# Altium schematic sheet BMS_V3.SchDoc: QEV1/2 Battery Management System
size A3; DrawnBy: Billy Currie, Alistair Ridge; Organization: QUT Motorsport; Address1: O-120, O Block; Address2: QUT Gardnes Point; Address3: Brisbane, QLD; Address4: Australia, 4000; DocumentNumber: 1000000; Revision: V1.1; SheetNumber: 1; SheetTotal: 1
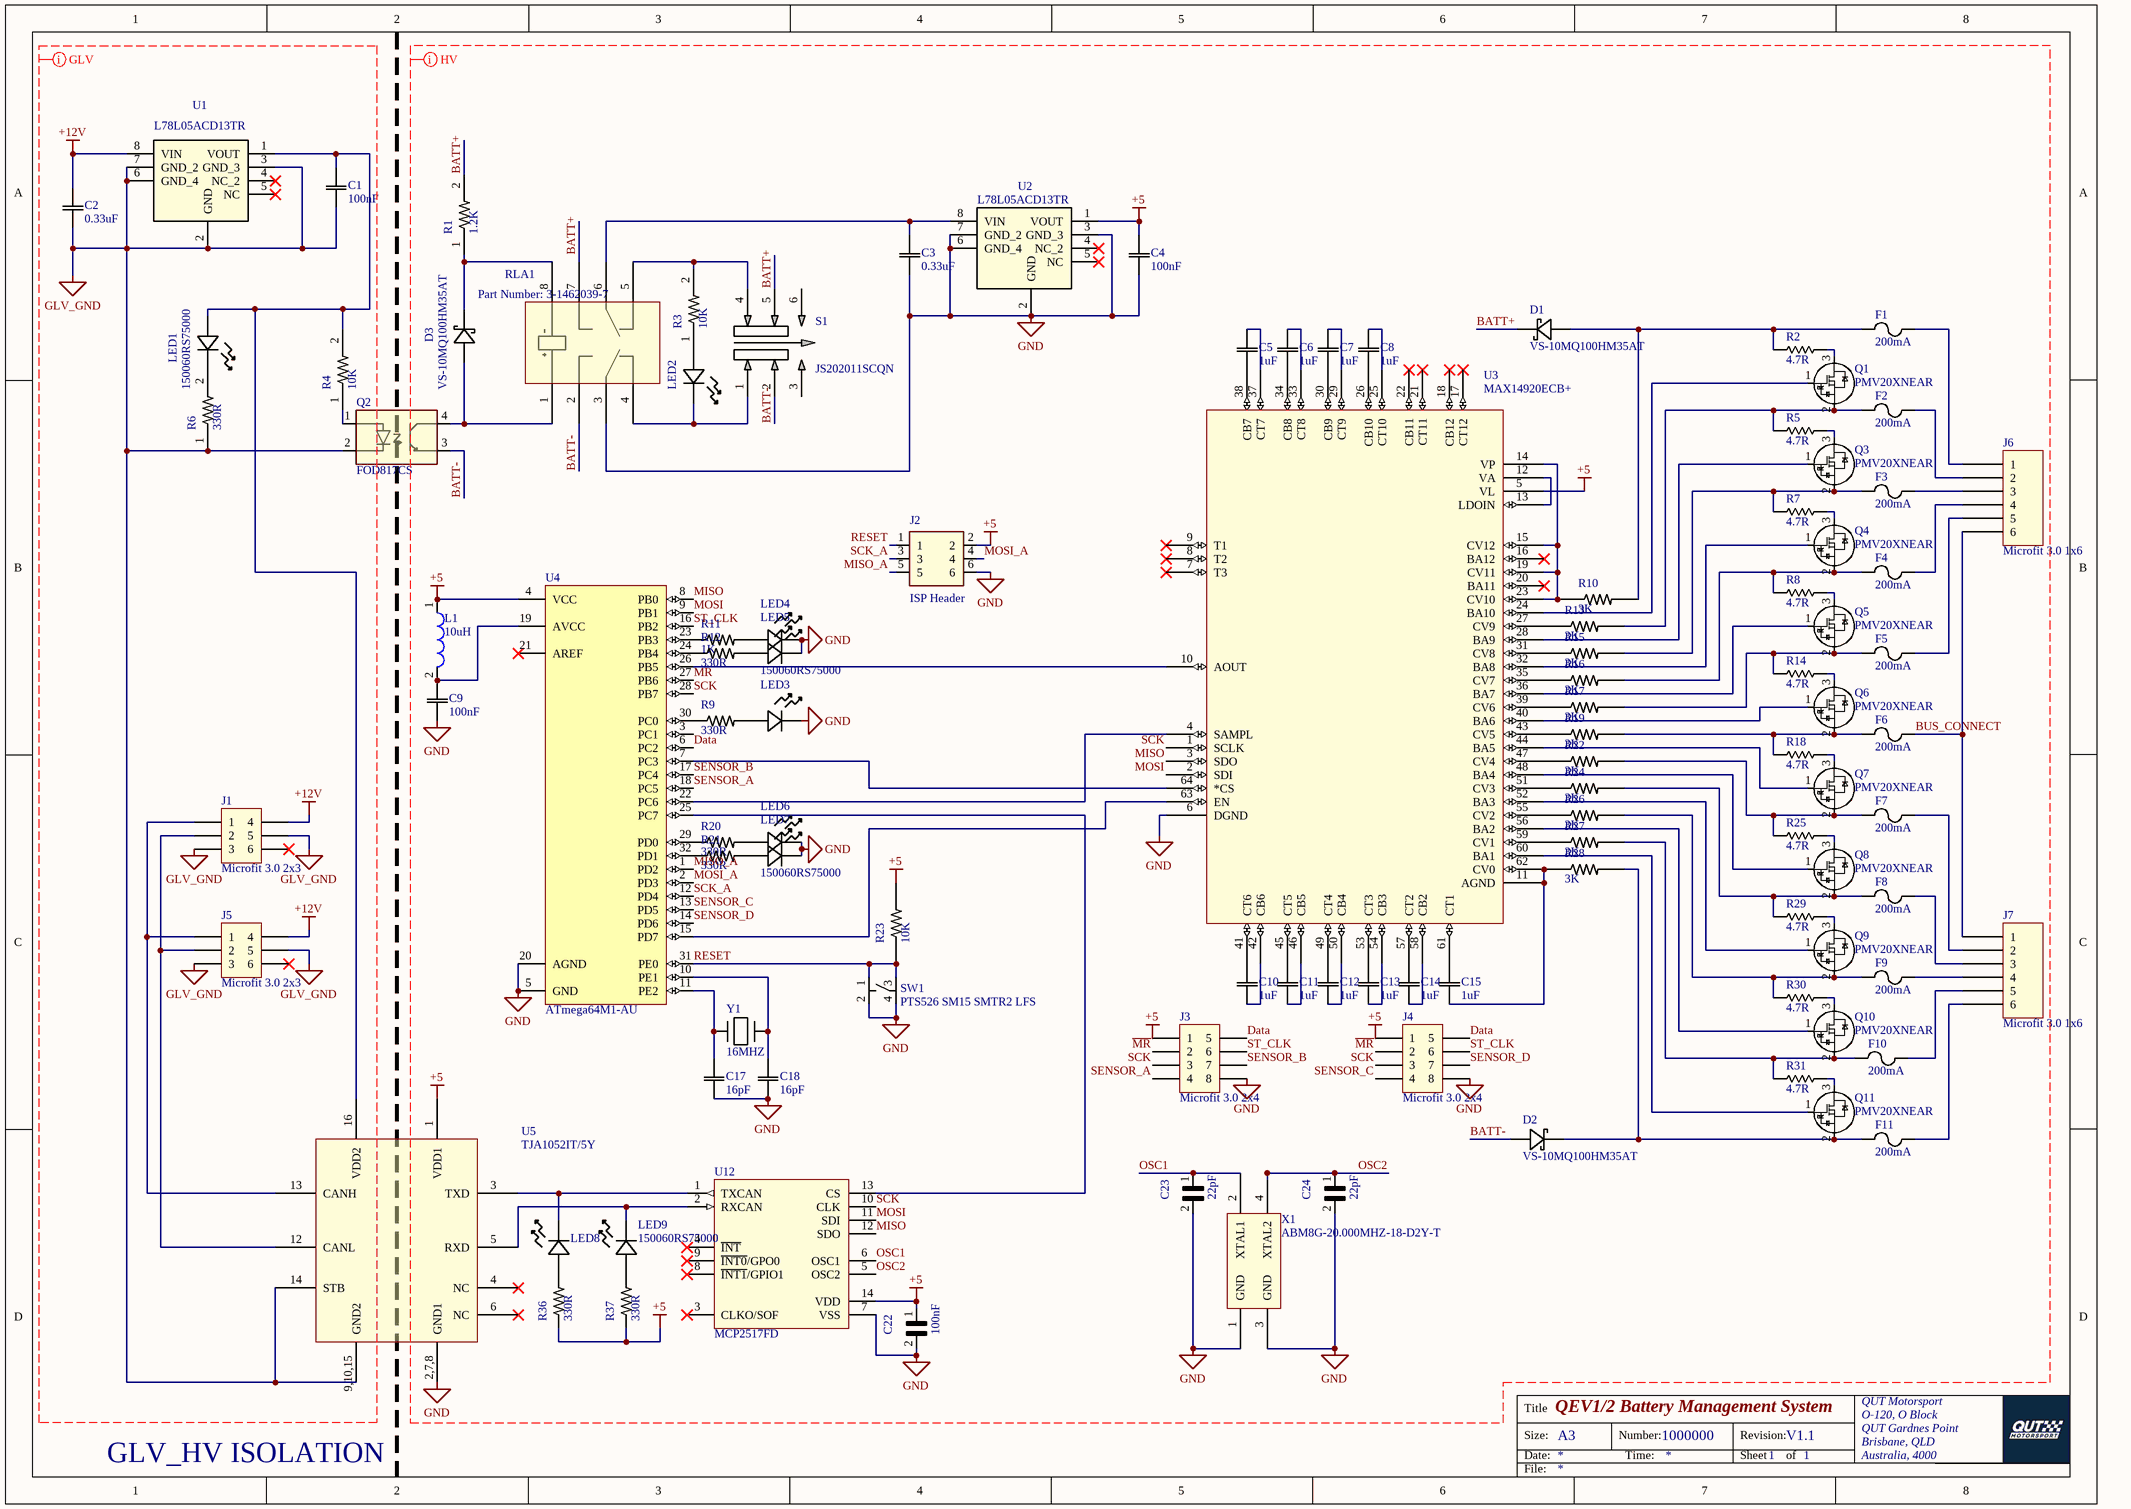
[diagram p0: BMS_V3.SchDoc]

## Parts
C1  100nF  [cap_UMK107ABJ400]
C2  0.33uF  [cap_UMK107ABJ400]
C3  0.33uF  [cap_UMK107ABJ400]
C4  100nF  [cap_UMK107ABJ400]
C5  1uF  [cap_UMK107ABJ400]
C6  1uF  [cap_UMK107ABJ400]
C7  1uF  [cap_UMK107ABJ400]
C8  1uF  [cap_UMK107ABJ400]
C9  100nF  [cap_UMK107ABJ400]
C10  1uF  [cap_UMK107ABJ400]
C11  1uF  [cap_UMK107ABJ400]
C12  1uF  [cap_UMK107ABJ400]
C13  1uF  [cap_UMK107ABJ400]
C14  1uF  [cap_UMK107ABJ400]
C15  1uF  [cap_UMK107ABJ400]
C17  16pF  [cap_UMK107ABJ400]
C18  16pF  [cap_UMK107ABJ400]
C22  100nF  [*CAPC1608X95]
C23  22pF  [*CAPC1608X95]
C24  22pF  [*CAPC1608X95]
D1  VS-10MQ100HM35AT  [DIODE_SMA]
D2  VS-10MQ100HM35AT  [DIODE_SMA]
D3  VS-10MQ100HM35AT  [DIODE_SMA]
F1  200mA  [0458Series]
F2  200mA  [0458Series]
F3  200mA  [0458Series]
F4  200mA  [0458Series]
F5  200mA  [0458Series]
F6  200mA  [0458Series]
F7  200mA  [0458Series]
F8  200mA  [0458Series]
F9  200mA  [0458Series]
F10  200mA  [0458Series]
F11  200mA  [0458Series]
J1  Microfit 3.0 2x3  [Microfit_2X3_R_TH]
J2  ISP Header  [CONN_1241050-3_T]
J3  Microfit 3.0 2x4  [Microfit_2X4_R_TH]
J4  Microfit 3.0 2x4  [Microfit_2X4_R_TH]
J5  Microfit 3.0 2x3  [Microfit_2X3_R_TH]
J6  Microfit 3.0 1x6  [Microfit_1X6_R_TH]
J7  Microfit 3.0 1x6  [Microfit_1X6_R_TH]
L1  10uH  [SMD 0603_A]
LED1  150060RS75000  [LED_LTW-C193TS00]
LED2  150060RS75000  [LED_LTW-C193TS00]  (value not drawn)
LED3  150060RS75000  [LED_LTW-C193TS00]  (value not drawn)
LED4  150060RS75000  [LED_LTW-C193TS00]  (value not drawn)
LED5  150060RS75000  [LED_LTW-C193TS00]
LED6  150060RS75000  [LED_LTW-C193TS00]  (value not drawn)
LED7  150060RS75000  [LED_LTW-C193TS00]
LED8  150060RS75000  [LED_LTW-C193TS00]  (value not drawn)
LED9  150060RS75000  [LED_LTW-C193TS00]
Q1  PMV20XNEAR  [SOT95P230X110-3N]
Q2  FOD817CS  [*SOIC254P1016X385-4N]
Q3  PMV20XNEAR  [SOT95P230X110-3N]
Q4  PMV20XNEAR  [SOT95P230X110-3N]
Q5  PMV20XNEAR  [SOT95P230X110-3N]
Q6  PMV20XNEAR  [SOT95P230X110-3N]
Q7  PMV20XNEAR  [SOT95P230X110-3N]
Q8  PMV20XNEAR  [SOT95P230X110-3N]
Q9  PMV20XNEAR  [SOT95P230X110-3N]
Q10  PMV20XNEAR  [SOT95P230X110-3N]
Q11  PMV20XNEAR  [SOT95P230X110-3N]
R1  1.2K  [RESC1608X55N]
R2  4.7R  [RES_SMF3_TYCO]
R3  10K  [RESC1608X55N]
R4  10K  [RESC1608X55N]
R5  4.7R  [RES_SMF3_TYCO]
R6  330R  [RESC1608X55N]
R7  4.7R  [RES_SMF3_TYCO]
R8  4.7R  [RES_SMF3_TYCO]
R9  330R  [RESC1608X55N]
R10  3K  [RESC1608X55N]
R11  1K  [RESC1608X55N]
R12  330R  [RESC1608X55N]
R13  3K  [RESC1608X55N]
R14  4.7R  [RES_SMF3_TYCO]
R15  3K  [RESC1608X55N]
R16  3K  [RESC1608X55N]
R17  3K  [RESC1608X55N]
R18  4.7R  [RES_SMF3_TYCO]
R19  3K  [RESC1608X55N]
R20  330R  [RESC1608X55N]
R21  330R  [RESC1608X55N]
R22  3K  [RESC1608X55N]
R23  10K  [RESC1608X55N]
R24  3K  [RESC1608X55N]
R25  4.7R  [RES_SMF3_TYCO]
R26  3K  [RESC1608X55N]
R27  3K  [RESC1608X55N]
R28  3K  [RESC1608X55N]
R29  4.7R  [RES_SMF3_TYCO]
R30  4.7R  [RES_SMF3_TYCO]
R31  4.7R  [RES_SMF3_TYCO]
R36  330R  [RESC1608X55N]
R37  330R  [RESC1608X55N]
RLA1  Part Number: 3-1462039-7  [RELAY8_SMTGUL]
S1  JS202011SCQN  [SW_JS202011SCQN]
SW1  PTS526 SM15 SMTR2 LFS  [PTS526SK15SMTR2LFS]
U1  L78L05ACD13TR  [SOIC127P600X175-8N]
U2  L78L05ACD13TR  [SOIC127P600X175-8N]
U3  MAX14920ECB+  [21-0084C]
U4  ATmega64M1-AU  [32A_L]
U5  TJA1052IT/5Y  [SOIC127P1032X265-16N]
U12  MCP2517FD  [MCP2517FD SOIC]
X1  ABM8G-20.000MHZ-18-D2Y-T  [XTAL 3.2x2.5mm]
Y1  16MHZ  [ABLS_Series]

## Nets
+5: C4.2 C22.1 J2.2 J3.1 J4.1 L1.1 R23.2 R36.1 R37.1 U2.1(VOUT) U3.5(VL) U4.4(VCC) U5.1(VDD1) U12.14(VDD)
+12V: C2.2 J1.4 J5.4 U1.8(VIN)
GLV_GND: C1.1 C2.1 J1.3 J1.5 J5.3 J5.5 Q2.2(CATHODE) R6.1 U1.2(GND) U1.3(GND_3) U1.6(GND_4) U1.7(GND_2) U5.9,10,15(GND2) U5.14(STB)
GND: C3.1 C4.1 C9.1 C17.1 C18.1 C22.2 C23.2 C24.2 J2.6 J3.8 J4.8 LED3.1 LED4.1 LED5.1 LED6.1 LED7.1 RLA1.3 SW1.2 SW1.4 U2.2(GND) U2.3(GND_3) U2.6(GND_4) U2.7(GND_2) U3.6(DGND) U4.5(GND) U4.20(AGND) U5.2,7,8(GND1) U12.7(VSS) X1.1(GND) X1.3(GND)
BATT+: D1.1 R1.2 RLA1.7 S1.5
BATT-: D2.2 Q2.3(EMITTER) RLA1.2 S1.2
BUS_CONNECT: F6.2 J6.6 J7.1
Data: J3.5 J4.5 U4.6(PC2)
~{MR}: J3.2 J4.2 U4.27(PB6)
MISO: U3.3(SDO) U4.8(PB0) U12.12(SDO)
MISO_A: J2.5 U4.1(PD2)
MOSI: U3.2(SDI) U4.9(PB1) U12.11(SDI)
MOSI_A: J2.4 U4.2(PD3)
OSC1: C23.1 U12.6(OSC1) X1.2(XTAL1)
OSC2: C24.1 U12.5(OSC2) X1.4(XTAL2)
RESET: J2.1 R23.1 SW1.1 SW1.3 U4.31(PE0)
SCK: J3.3 J4.3 U3.1(SCLK) U4.28(PB7) U12.10(CLK)
SCK_A: J2.3 U4.12(PD4)
SENSOR_A: J3.4 U4.18(PC5)
SENSOR_B: J3.7 U4.17(PC4)
SENSOR_C: J4.4 U4.13(PD5)
SENSOR_D: J4.7 U4.14(PD6)
ST_CLK: J3.6 J4.6 U4.16(PB2)
NetC1_2: C1.2 LED1.2 R4.2 U1.1(VOUT) U5.16(VDD2)
NetC3_2: C3.2 RLA1.6 U2.8(VIN)
NetC5_1: C5.1 U3.38(CB7)
NetC5_2: C5.2 U3.37(CT7)
NetC6_1: C6.1 U3.34(CB8)
NetC6_2: C6.2 U3.33(CT8)
NetC7_1: C7.1 U3.30(CB9)
NetC7_2: C7.2 U3.29(CT9)
NetC8_1: C8.1 U3.26(CB10)
NetC8_2: C8.2 U3.25(CT10)
NetC9_2: C9.2 L1.2 U4.19(AVCC)
NetC10_1: C10.1 U3.42(CB6)
NetC10_2: C10.2 U3.41(CT6)
NetC11_1: C11.1 U3.46(CB5)
NetC11_2: C11.2 U3.45(CT5)
NetC12_1: C12.1 U3.50(CB4)
NetC12_2: C12.2 U3.49(CT4)
NetC13_1: C13.1 U3.54(CB3)
NetC13_2: C13.2 U3.53(CT3)
NetC14_1: C14.1 U3.58(CB2)
NetC14_2: C14.2 U3.57(CT2)
NetC15_1: C15.1 R28.1 U3.11(AGND) U3.62(CV0)
NetC15_2: C15.2 U3.61(CT1)
NetC17_2: C17.2 U4.11(PE2) Y1.2
NetC18_2: C18.2 U4.10(PE1) Y1.1
NetD1_2: D1.2 F1.1 R2.2 R10.2
NetD2_1: D2.1 F11.1 Q11.2 R28.2
NetD3_1: D3.1 R1.1 RLA1.8
NetD3_2: D3.2 Q2.4(COLLECTOR) RLA1.1
NetF1_2: F1.2 J6.1
NetF2_1: F2.1 Q1.2 R5.2 R13.2
NetF2_2: F2.2 J6.2
NetF3_1: F3.1 Q3.2 R7.2 R15.2
NetF3_2: F3.2 J6.3
NetF4_1: F4.1 Q4.2 R8.2 R16.2
NetF4_2: F4.2 J6.4
NetF5_1: F5.1 Q5.2 R14.2 R17.2
NetF5_2: F5.2 J6.5
NetF6_1: F6.1 Q6.2 R18.2 R19.2
NetF7_1: F7.1 Q7.2 R22.2 R25.2
NetF7_2: F7.2 J7.2
NetF8_1: F8.1 Q8.2 R24.2 R29.2
NetF8_2: F8.2 J7.3
NetF9_1: F9.1 Q9.2 R26.2 R30.2
NetF9_2: F9.2 J7.4
NetF10_1: F10.1 Q10.2 R27.2 R31.2
NetF10_2: F10.2 J7.5
NetF11_2: F11.2 J7.6
NetJ1_1: J1.1 J5.1 U5.13(CANH)
NetJ1_2: J1.2 J5.2 U5.12(CANL)
NetLED1_1: LED1.1 R6.2
NetLED2_1: LED2.1 RLA1.4 S1.1
NetLED2_2: LED2.2 R3.1
NetLED3_2: LED3.2 R9.2
NetLED4_2: LED4.2 R11.2
NetLED5_2: LED5.2 R12.2
NetLED6_2: LED6.2 R20.2
NetLED7_2: LED7.2 R21.2
NetLED8_1: LED8.1 U5.3(TXD) U12.1(TXCAN)
NetLED8_2: LED8.2 R36.2
NetLED9_1: LED9.1 U5.5(RXD) U12.2(RXCAN)
NetLED9_2: LED9.2 R37.2
NetQ1_1: Q1.1 U3.24(BA10)
NetQ1_3: Q1.3 R2.1
NetQ2_1: Q2.1(ANODE) R4.1
NetQ3_1: Q3.1 U3.28(BA9)
NetQ3_3: Q3.3 R5.1
NetQ4_1: Q4.1 U3.32(BA8)
NetQ4_3: Q4.3 R7.1
NetQ5_1: Q5.1 U3.36(BA7)
NetQ5_3: Q5.3 R8.1
NetQ6_1: Q6.1 U3.40(BA6)
NetQ6_3: Q6.3 R14.1
NetQ7_1: Q7.1 U3.44(BA5)
NetQ7_3: Q7.3 R18.1
NetQ8_1: Q8.1 U3.48(BA4)
NetQ8_3: Q8.3 R25.1
NetQ9_1: Q9.1 U3.52(BA3)
NetQ9_3: Q9.3 R29.1
NetQ10_1: Q10.1 U3.56(BA2)
NetQ10_3: Q10.3 R30.1
NetQ11_1: Q11.1 U3.60(BA1)
NetQ11_3: Q11.3 R31.1
NetR3_2: R3.2 RLA1.5 S1.4
NetR9_1: R9.1 U4.30(PC0)
NetR10_1: R10.1 U3.14(VP) U3.15(CV12) U3.19(CV11) U3.23(CV10)
NetR11_1: R11.1 U4.23(PB3)
NetR12_1: R12.1 U4.24(PB4)
NetR13_1: R13.1 U3.27(CV9)
NetR15_1: R15.1 U3.31(CV8)
NetR16_1: R16.1 U3.35(CV7)
NetR17_1: R17.1 U3.39(CV6)
NetR19_1: R19.1 U3.43(CV5)
NetR20_1: R20.1 U4.29(PD0)
NetR21_1: R21.1 U4.32(PD1)
NetR22_1: R22.1 U3.47(CV4)
NetR24_1: R24.1 U3.51(CV3)
NetR26_1: R26.1 U3.55(CV2)
NetR27_1: R27.1 U3.59(CV1)
NetU3_4: U3.4(SAMPL) U4.22(PC6)
NetU3_10: U3.10(AOUT) U4.26(PB5)
NetU3_12: U3.12(VA) U3.13(LDOIN)
NetU3_63: U3.63(EN) U4.15(PD7)
NetU3_64: U3.64(*CS) U4.7(PC3)
NetU4_25: U4.25(PC7) U12.13(CS)

Not connected (* = marked no-connect by the designer): J1 6*; J5 6*; S1 3 6; U1 4(NC_2)* 5(NC)*; U2 4(NC_2)* 5(NC)*; U3 7(T3)* 8(T2)* 9(T1)* 16(BA12)* 17(CT12)* 18(CB12)* 20(BA11)* 21(CT11)* 22(CB11)*; U4 3(PC1) 21(AREF)*; U5 4(NC)* 6(NC)*; U12 3(CLKO/SOF)* 4(~{INT})* 8(~{INT1}/GPIO1)* 9(~{INT0}/GPO0)*

## Layout directives
rule Power Plane Clearance [Clearance = 5mm]; net class HV: +5, BATT+, BATT-, BUS_CONNECT, Data, GND, MISO, MISO_A, MOSI, MOSI_A, OSC1, OSC2, RESET, SCK, SCK_A, SENSOR_A, SENSOR_B, SENSOR_C, SENSOR_D, ST_CLK, ~{MR}
net class GLV; rule Power Plane Clearance [Clearance = 5mm]: +12V, GLV_GND

## Notes on the sheet
- GLV_HV ISOLATION
- Title
- Size:
- Date:
- A3
- Number:
- Time:
- Revision:
- Sheet
- of
- File:

## Library data of the parts
C1-C15 C17 C18 = EMK107BJ105KA-T: No Description Available; Vendor: Taiyo Yuden; Built_By: EMA_UL_Team; Type: DEV; Manufacturer_Part_Number: EMK107BJ105KA-T; Copyright: Copyright (C) 2018 Accelerated Designs. All rights reserved; RefDes: RefDes; Value: Value
C22-C24 = CGJ3E3X7R1E334K080AB: / Cap Ceramic 0.33uF 25V X7R 10% SMD 0603 125Â°C Punched Paper T/R /; MF: TDK; Digi-Key_Part_Number: 445-13347-1-ND; MP: CGJ3E3X7R1E334K080AB; SnapEDA_Link: https://www.snapeda.com/parts/CGJ3E3X7R1E334K080AB/TDK-Lambda%20Americas%20Inc/view-part/?ref=snap; Package: 0603 TDK; Digi-Key_Purchase_URL: https://www.digikey.com.au/product-detail/en/tdk-corporation/CGJ3E3X7R1E334K080AB/445-13347-1-ND/3955013?utm_source=snapeda&utm_medium=aggregator&utm_campaign=symbol; Value: *
D1-D3 = VS-10MQ100HM35AT: No Description Available; Manufacturer_Part_Number: VS-10MQ100NPBF; Vendor: Vishay; Built_By: EMA_UL_Team; Type: DEV; Copyright: Copyright (C) 2018 Accelerated Designs. All rights reserved; RefDes: RefDes; Value: Value
F1-F11 = 0458001.DR: No Description Available; Vendor: Littelfuse Inc; Built_By: EMA_UL_Team; Type: DEV; Manufacturer_Part_Number: 0458001.DR; Copyright: Copyright (C) 2018 Accelerated Designs. All rights reserved; RefDes: RefDes; Value: Value
J1 J5 = Microfit_2x3
J2 = 826634-3: Conn Unshrouded Header HDR 6 POS 2.54mm Solder RA Thru-Hole Automotive Carton; MF: TE Connectivity; Availability: Unavailable; SnapEDA_Link: https://www.snapeda.com/parts/826634-3/TE%20Connectivity%20AMP%20Connectors/view-part/?ref=snap; EU_RoHS_Compliance: Compliant; Price: None; TE_purchase_URL: https://www.te.com/usa-en/product-826634-3.html?te_bu=Cor&te_type=disp&te_campaign=seda_glo_cor-seda-global-disp-prtnr-fy19-seda-model-bom-cta_sma-317_1&elqCampaignId=32493; Package: None; MP: 826634-3; Value: *
J3 J4 = Microfit_2x4
J6 J7 = Microfit_1x6
L1 = CMP-1392-00021-1: FIXED IND 10UH 3MA 2.55 OHM SMD; PartNumber: 74479763147; Manufacturer: Wuerth Elektronik; Inductance: 0.47 ÂµH; ComponentLink1Description: Manufacturer URL; PackageReference: SMD 0603_A; ComponentLink2Description: Datasheet; ComponentLink2URL: http://katalog.we-online.de/kataloge/eisos/media/pdf/74479763147.pdf; ComponentLink1URL: http://www.we-online.com
LED1-LED9 = LTST-C191TGKT: No Description Available; Built_By: EMA_Justin; Vendor: Lite-On; Type: DEV; Copyright: Copyright (C) 2016 Accelerated Designs. All rights reserved; Manufacturer_Part_Number: LTST-C191TGKT; RefDes: RefDes; Value: Value
Q1 Q3-Q11 = SOT95P230X110-3N
Q2 = FOD817CS: Optocoupler DC-IN 1-CH Transistor DC-OUT 4-Pin PDIP SMD Black Box; MF: ON; SnapEDA_Link: https://www.snapeda.com/parts/FOD817CS/ON%20Semiconductor/view-part/?ref=snap; Digi-Key_Part_Number: FOD817CS-ND; MP: FOD817CS; Package: SMD-4 Fairchild Semiconductor; Digi-Key_Purchase_URL: https://www.digikey.com/product-detail/en/on-semiconductor/FOD817CS/FOD817CS-ND/1049610?utm_source=snapeda&utm_medium=aggregator&utm_campaign=symbol; Value: *
R1 = 10K: / Res Thick Film 0603 1.2K Ohm 5% 0.25W_1/4W_ Â±200ppm/C Molded SMD Automotive T/R /; MP: ESR03EZPJ103; MF: Rohm; Package: 0603 Rohm; SnapEDA_Link: https://www.snapeda.com/parts/ESR03EZPJ103/Rohm/view-part/?ref=snap; Price: None; Availability: Unavailable; Value: *
R2 R5 R7 R8 R14 R18 R25 R29-R31 = SMW34R7JT: No Description Available; Vendor: TE Connectivity; Built_By: EMA_UL_Team; Manufacturer_Part_Number: SMW34R7JT; Copyright: Copyright (C) 2018 Accelerated Designs. All rights reserved; RefDes: RefDes; Type: DEV; Value: Value
R3 R4 R6 R10 R13 R15-R17 R19 R22-R24 R26-R28 = 10K: / Res Thick Film 0603 10K Ohm 5% 0.25W_1/4W_ Â±200ppm/C Molded SMD Automotive T/R /; MP: ESR03EZPJ103; MF: Rohm; Package: 0603 Rohm; SnapEDA_Link: https://www.snapeda.com/parts/ESR03EZPJ103/Rohm/view-part/?ref=snap; Price: None; Availability: Unavailable; Value: *
R9 = 10K: / Res Thick Film 0603 220K Ohm 1% 0.1W_1/10W_ Â±100ppm/C Molded SMD Automotive Paper T/R /; MF: Vishay Dale; Package: 0603 Vishay; Price: None; SnapEDA_Link: https://www.snapeda.com/parts/CRCW0603220KFKEA/Vishay%20Dale/view-part/?ref=snap; Availability: Unavailable; MP: CRCW0603220KFKEA; Value: *
R11 R12 R20 R21 R36 R37 = CRCW0603220KFKEA: / Res Thick Film 0603 220K Ohm 1% 0.1W_1/10W_ Â±100ppm/C Molded SMD Automotive Paper T/R /; MF: Vishay Dale; Package: 0603 Vishay; Price: None; SnapEDA_Link: https://www.snapeda.com/parts/CRCW0603220KFKEA/Vishay%20Dale/view-part/?ref=snap; Availability: Unavailable; MP: CRCW0603220KFKEA; Value: *
RLA1 = 3-1462039-7: No Description Available; Vendor: TE Connectivity; Built_By: EMA_UL_Team; Copyright: Copyright (C) 2016 Accelerated Designs. All rights reserved; Manufacturer_Part_Number: 3-1462039-7; RefDes: RefDes; Type: DEV; Value: Value
S1 = JS202011SCQN: JS Series DPDT On-On Gull Wing Surface Mount Subminiature Slide Switch; MF: C&K; MP: JS202011SCQN; Package: None; Availability: Unavailable; Price: None; SnapEDA_Link: https://www.snapeda.com/parts/JS202011SCQN/C%26K/view-part/?ref=snap; Value: *
SW1 = PTS526 SM15 SMTR2 LFS: TACT 5.2 X 5.2, 1.5 MM H, 160GF, / SPST-NO Top Actuated Surface Mount
U1 U2 = L78L05ACD13TR: L78L Series 20 V 100 mA Surface Mount Positive Voltage Regulator - SOIC-8; MF: STMicroelectronics; Package: SOIC-8 STMicroelectronics; MP: L78L05ACD13TR; SnapEDA_Link: https://www.snapeda.com/parts/L78L05ACD13TR/STMicroelectronics/view-part/?ref=snap; Price: None; Availability: Unavailable; Value: *
U3 = MAX14920ECB+: No Description Available; Built_By: EMA_UL_Team; Vendor: Maxim Integrated Products; Manufacturer_Part_Number: MAX14920ECB+; Copyright: Copyright (C) 2018 Accelerated Designs. All rights reserved; RefDes: RefDes; Type: DEV; Value: Value
U4 = CMP-0096-00131-2: 8-bit AVR Microcontroller, 2.7-5.5V, 16MHz, 64KB Flash, 2KB EEPROM, 4KB SRAM, Industrial Grade (-40° to +85°C), 32-Pin TQFP; Code_JEDEC: MS-026-ABA; PackageVersion: revC, Oct-2010; ComponentLink2Description: ATmega16M1/32M1/64M1 Datasheet; ComponentLink1Description: Manufacturer URL; DatasheetVersion: revD, Nov-2010; ComponentLink3Description: ATmega16M1/32M1/64M1 Summary; ComponentLink1URL: http://www.atmel.com/; RevisionNote: DatasheetVersion & PackageVersion updated. URLs added.; PackageReference: 32A; ComponentLink3URL: http://www.atmel.com/dyn/resources/prod_documents/8209S.pdf; PackageDescription: 32-Lead, 7x7x1.0 mm Body, 0.8mm Lead Pitch, Thin Profile Plastic Quad Flat Package (TQFP); ComponentLink2URL: http://www.atmel.com/dyn/resources/prod_documents/doc8209.pdf
X1 = Crystal 20Mhz 3.2x2.5mm: 20MHz ±20ppm Crystal 18pF 80 Ohms 4-SMD, No Lead; ComponentLink1Description: Digikey; ComponentLink1URL: https://www.digikey.com.au/product-detail/en/abracon-llc/ABM8G-20.000MHZ-18-D2Y-T/535-10271-1-ND/2218084; ComponentLink2Description: Datasheet; ComponentLink2URL: https://abracon.com/Resonators/ABM8G.pdf; ComponentLink3Description: Drawing; ComponentLink3URL: https://abracon.com/Support/PackageDrawing/Resonators/ABM8G.PDF
Y1 = ABLS-28.63636MHZ: No Description Available; Manufacturer_Part_Number: ABLS-28.63636MHZ-CL-RESR-A-1-G-F; Vendor: Abracon; Built_By: EMA_UL_Team; Copyright: Copyright (C) 2018 Accelerated Designs. All rights reserved; RefDes: RefDes; Type: DEV; Value: Value